# Altium schematic sheet Power_Decap.SchDoc: Power
size A4; Date: 01/09/2020; ApprovedBy: Edson Manoel da Silva; CheckedBy: Edson Manoel da Silva; Author: Edson Manoel da Silva; CompanyName: EMS; DrawnBy: Edson Manoel da Silva; Engineer: Edson Manoel da Silva; Organization: EMS; Address1: Av Helvino Moraes, 1385; Address2: APT 11E; Address3: Vila São José; Address4: Taubaté/SP - Brasil; DocumentNumber: 1; Revision: 1; SheetNumber: 1; SheetTotal: 5; Rule: 5
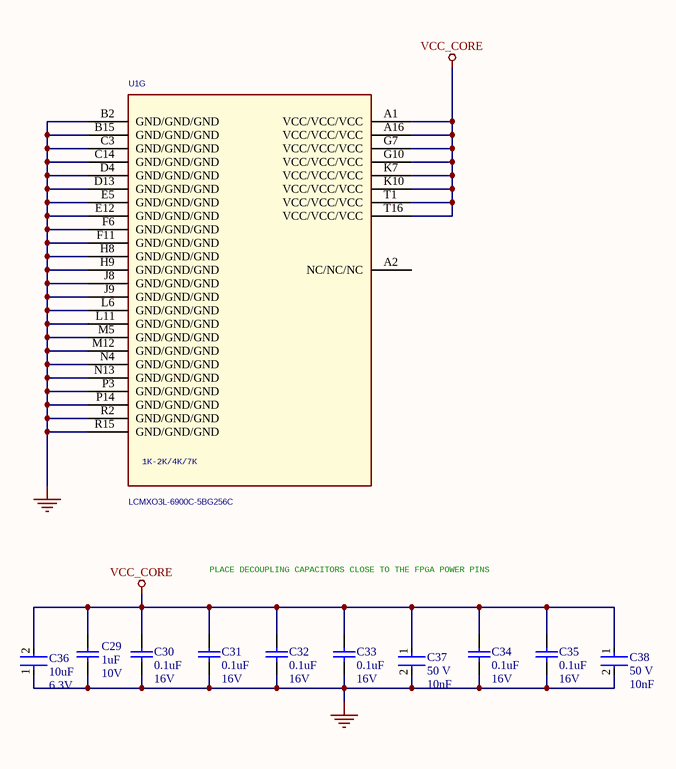
[diagram p0: Power_Decap.SchDoc]

## Parts
C29  value 1uF  Voltage: 10V  [CAPC1608X90X35ML15T15]  (hidden comment: C0603C105K8RACTU)
C30  value 0.1uF  Voltage: 16V  [CAPC1608X87X35ML15T15]  (hidden comment: C0603C104M4RACTU)
C31  value 0.1uF  Voltage: 16V  [CAPC1608X87X35ML15T15]  (hidden comment: C0603C104M4RACTU)
C32  value 0.1uF  Voltage: 16V  [CAPC1608X87X35ML15T15]  (hidden comment: C0603C104M4RACTU)
C33  value 0.1uF  Voltage: 16V  [CAPC1608X87X35ML15T15]  (hidden comment: C0603C104M4RACTU)
C34  value 0.1uF  Voltage: 16V  [CAPC1608X87X35ML15T15]  (hidden comment: C0603C104M4RACTU)
C35  value 0.1uF  Voltage: 16V  [CAPC1608X87X35ML15T15]  (hidden comment: C0603C104M4RACTU)
C36  value 10uF  Voltage: 6.3V  [FP-CL10-IPC_C]  (hidden comment: CL10A106MQ8NNNC)
C37  value 10nF  Voltage: 50 V  [FP-C0805C-DN-MFG]  (hidden comment: C0805C103K5RACAUTO)
C38  value 10nF  Voltage: 50 V  [FP-C0805C-DN-MFG]  (hidden comment: C0805C103K5RACAUTO)
U1  LCMXO3L-6900C-5BG256C  [BGA256C80P16X16_1400X1400X170]  (part G of 7)

## Nets
GND: C29.1 C30.2 C31.2 C32.2 C33.2 C34.2 C35.2 C36.1 C37.2 C38.2 U1.B2(GND/GND/GND) U1.B15(GND/GND/GND) U1.C3(GND/GND/GND) U1.C14(GND/GND/GND) U1.D4(GND/GND/GND) U1.D13(GND/GND/GND) U1.E5(GND/GND/GND) U1.E12(GND/GND/GND) U1.F6(GND/GND/GND) U1.F11(GND/GND/GND) U1.H8(GND/GND/GND) U1.H9(GND/GND/GND) U1.J8(GND/GND/GND) U1.J9(GND/GND/GND) U1.L6(GND/GND/GND) U1.L11(GND/GND/GND) U1.M5(GND/GND/GND) U1.M12(GND/GND/GND) U1.N4(GND/GND/GND) U1.N13(GND/GND/GND) U1.P3(GND/GND/GND) U1.P14(GND/GND/GND) U1.R2(GND/GND/GND) U1.R15(GND/GND/GND)
VCC_CORE: C29.2 C30.1 C31.1 C32.1 C33.1 C34.1 C35.1 C36.2 C37.1 C38.1 U1.A1(VCC/VCC/VCC) U1.A16(VCC/VCC/VCC) U1.G7(VCC/VCC/VCC) U1.G10(VCC/VCC/VCC) U1.K7(VCC/VCC/VCC) U1.K10(VCC/VCC/VCC) U1.T1(VCC/VCC/VCC) U1.T16(VCC/VCC/VCC)

Not connected (* = marked no-connect by the designer): U1 A2(NC/NC/NC)

## Notes on the sheet
- PLACE DECOUPLING CAPACITORS CLOSE TO THE FPGA POWER PINS
- Title
- Size:
- Date:
- A4
- Number:
- Time:
- Revision:
- Sheet
- of
- File:
- (in symbol LCMXO3L-1K/2K/4K/7K-BG256, part G) 1K-2K/4K/7K

## Library data of the parts
C29 = CMP-2006-02293-1: Manufacturer: Kemet; Alternative1: CL10B105KO8NNND Samsung; Alternative2: CC0603KPX7R7BB105 Yageo; Alternative3: GRM188R71C105KE15D Murata; Part Number: C0603C105K8RACTU; Package / Case: 0603
C30-C35 = CMP-2006-03067-1: Ceramic Capacitor 0.1uF 16V +-10% X7R0603; Manufacturer: Kemet; Alternative1: C1608X7R1E104K TDK; Alternative2: CC0603KRX7R8BB104 Yageo; Alternative3: GRM188R72A104KA35D Murata; Part Number: C0603C104M4RACTU; Package / Case: 0603
C36 = CMP-13271-001938-1: Cap Ceramic 10uF 6.3V X5R ±20% Pad SMD 0603 +85°C T/R; Manufacturer: Samsung; Alternative1: LMK107BJ106MALTD Taiyo Yuden; Alternative2: C1608X5R0J106K080AB TDK; Alternative3: 06036D106MAT2A Kyocera AVX; Height: 0.8mm; Width: 0.031inch; Min Operating Temperature: -55°C; Dielectric: X5R; Package / Case: 0603; Radiation Hardening: No; Packaging: Tape and Reel; Max Operating Temperature: 85°C; Thickness: 0.035inch; Mount: Surface Mount; Case Code (Imperial): 0603; Case Code (Metric): 1608; Depth: 0.8mm; Tolerance: 20%; Length: 1.6mm; Part Number: CL10A106MQ8NNNC
C37 C38 = CMP-03020-006206-1: CAP CER 10000PF 50V X7R 0805; Manufacturer: KEMET; Material: Ceramic; Temperature Coefficient: 30ppm/°C; Alternative1: GRM21BR72A103KA01L Murata; Alternative2: C0805F103K5RACTU KEMET; Alternative3: 08055C103JAT2A Kyocera AVX; Height: 0.88mm; Temperature Characteristic: X7R; Part Number: C0805C103K5RACAUTO; ComponentLink2URL: https://content.kemet.com/datasheets/KEM_C1003_C0G_SMD.pdf; RoHS: TRUE; Temperature: -55°C to +125°C; Temperature Range Low: -55°C; ComponentLink2Description: Datasheet; Package / Case: C0805C-DN; Lead Free: Yes
U1 = LCMXO3L-1K/2K/4K/7K-BG256: IC FPGA 6864LUTS 256BGA; Manufacturer: Lattice semi; SPLIT_INST: TRUE; SWAP_INFO: (S1+S2+S3+S4+S5+S6+S7); Graphic: LCMXO3L-1K/2K/4K/7K-BG256A.Normal; Power Pins Visible: False; Source Library: D:\DESIGN_DOC\XO3\LATTICEORCADCAPTURESCHEMATICLIBRARYOLB\LATTICEORCADCAPTURESCHEMATICLIBRARYOLB\LATTICE_SYM\LATTICEPLDS.OLB; Location Y-Coordinate: 0; Implementation Type: <none>; Primitive: DEFAULT; Name: I16790692; Digikey P/N: 220-1886-ND; Part Number: LCMXO3L-6900C-5BG256C; Source Package: LCMXO3L-1K/2K/4K/7K-BG256; Source Part: LCMXO3L-1K/2K/4K/7K-BG256A.Normal; Color: Default; Location X-Coordinate: 0